# Altium schematic sheet impulse.SchDoc: OPO
size Letter; Author: Kuo, Huang; Revision: 4.0; SheetNumber: 2; SheetTotal: 7
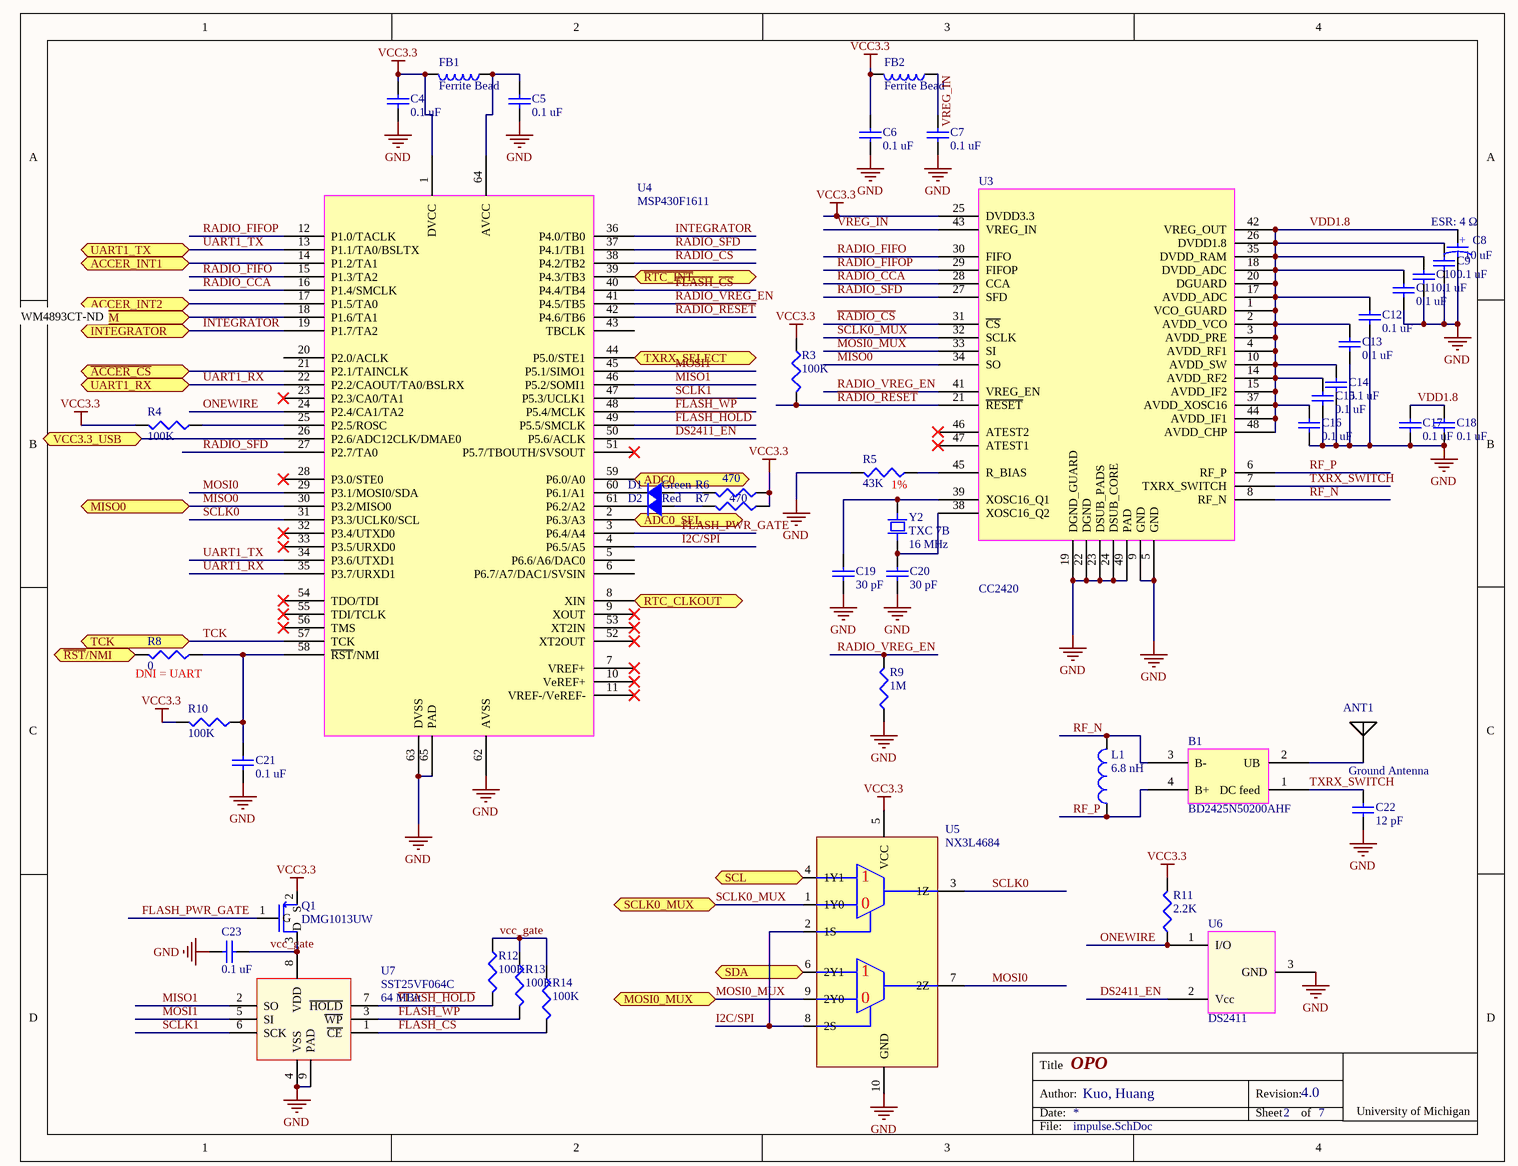
[diagram p0: impulse.SchDoc]

## Parts
ANT1  Ground Antenna  [Chip Antenna]
B1  BD2425N50200AHF  [BD2425N50200AHF]
C4  value 0.1 uF  [0402]  (hidden comment: Ceramic capacitor)
C5  value 0.1 uF  [0402]  (hidden comment: Ceramic capacitor)
C6  value 0.1 uF  [0402]  (hidden comment: Ceramic capacitor)
C7  value 0.1 uF  [0402]  (hidden comment: Ceramic capacitor)
C8  value 10 uF  ESR: 4 Ω  [0603 - Polar Marking]  (hidden comment: Tantalum capacitor)
C9  value 0.1 uF  [0402]  (hidden comment: Ceramic capacitor)
C10  value 0.1 uF  [0402]  (hidden comment: Ceramic capacitor)
C11  value 0.1 uF  [0402]  (hidden comment: Ceramic capacitor)
C12  value 0.1 uF  [0402]  (hidden comment: Ceramic capacitor)
C13  value 0.1 uF  [0402]  (hidden comment: Ceramic capacitor)
C14  value 0.1 uF  [0402]  (hidden comment: Ceramic capacitor)
C15  value 0.1 uF  [0402]  (hidden comment: Ceramic capacitor)
C16  value 0.1 uF  [0402]  (hidden comment: Ceramic capacitor)
C17  value 0.1 uF  [0402]  (hidden comment: Ceramic capacitor)
C18  value 0.1 uF  [0402]  (hidden comment: Ceramic capacitor)
C19  value 30 pF  [0402]  (hidden comment: Ceramic capacitor)
C20  value 30 pF  [0402]  (hidden comment: Ceramic capacitor)
C21  value 0.1 uF  [0402]  (hidden comment: Ceramic capacitor)
C22  value 12 pF  [0402]  (hidden comment: Ceramic capacitor)
C23  value 0.1 uF  [0402]  (hidden comment: Ceramic capacitor)
D1  Color: Green  [0402 - DIODE]  (hidden comment: LED, Green)
D2  Color: Red  [0402 - DIODE]  (hidden comment: LED, Red)
FB1  Ferrite Bead  [0402]
FB2  Ferrite Bead  [0402]
L1  value 6.8 nH  [0402]  (hidden comment: Chip inductor)
Q1  DMG1013UW  [SC70-3]
R3  value 100K  [0402]  (hidden comment: Chip resistor)
R4  value 100K  [0402]  (hidden comment: Chip resistor)
R5  value 43K  [0402]  (hidden comment: Chip resistor)
R6  value 470  [0402]  (hidden comment: Chip resistor)
R7  value 470  [0402]  (hidden comment: Chip resistor)
R8  value 0  [0402]  (hidden comment: Chip resistor)
R9  value 1M  [0402]  (hidden comment: Chip resistor)
R10  value 100K  [0402]  (hidden comment: Chip resistor)
R11  value 2.2K  [0402]  (hidden comment: Chip resistor)
R12  value 100K  [0402]  (hidden comment: Chip resistor)
R13  value 100K  [0402]  (hidden comment: Chip resistor)
R14  value 100K  [0402]  (hidden comment: Chip resistor)
U3  CC2420  [QFN50P700X700X100_HS-49N]
U4  MSP430F1611  [QFN50P900X900X90_HS-65N]
U5  NX3L4684  [QFN50P155X200X13-10N]
U6  DS2411  [SOT23-3N]
U7  SST25VF064C  Capacity: 64 MBit  [WSON]
Y2  TXC 7B  frequency: 16 MHz  [TXC 7B]

## Ports
ACCER_INT1, ACCER_INT2, ADC0, ADC0_SEL, INTEGRATOR, MISO0, MOSI0_MUX, PWM, RTC_CLKOUT, SCL, SCLK0_MUX, SDA, TCK, TXRX_SELECT, UART1_RX, UART1_TX, VCC3.3_USB, ~{ACCER_CS}, ~{RST}/NMI, ~{RTC_INT}

## Nets
GND: C4.2 C5.2 C6.2 C7.2 C8.2 C9.2 C10.2 C11.2 C12.2 C13.2 C14.2 C15.2 C16.2 C17.2 C18.2 C19.1 C20.1 C21.2 C22.2 C23.2 R5.1 R9.2 U3.5(GND) U3.9(GND) U3.19(DGND_GUARD) U3.22(DGND) U3.23(DSUB_PADS) U3.24(DSUB_CORE) U3.49(PAD) U4.62(AVSS) U4.63(DVSS) U4.65(PAD) U5.10(GND) U6.3(GND) U7.4(VSS) U7.9(PAD)
VCC3.3: C4.1 C6.1 FB1.1 FB2.1 Q1.2(S) R3.2 R4.1 R6.2 R7.2 R10.1 R11.1 U3.25(DVDD3.3) U4.1(DVCC) U5.5(VCC)
~{ACCER_CS}: U4.21(P2.1/TAINCLK) ; port ~{ACCER_CS}
ACCER_INT1: U4.14(P1.2/TA1) ; port ACCER_INT1
ACCER_INT2: U4.17(P1.5/TA0) ; port ACCER_INT2
ADC0: U4.59(P6.0/A0) ; port ADC0
ADC0_SEL: U4.2(P6.3/A3) ; port ADC0_SEL
DS2411_EN: U4.50(P5.6/ACLK) U6.2(Vcc)
~{FLASH_HOLD}: R12.1 U4.49(P5.5/SMCLK) U7.7(~{HOLD})
~{FLASH_WP}: R13.1 U4.48(P5.4/MCLK) U7.3(~{WP})
~{FLASH}_~{CS}: R14.1 U4.40(P4.4/TB4) U7.1(~{CE})
FLASH_PWR_GATE: Q1.1(G) U4.3(P6.4/A4)
I2C/SPI: U4.4(P6.5/A5) U5.2(1S) U5.8(2S)
INTEGRATOR: U4.19(P1.7/TA2) U4.36(P4.0/TB0) ; port INTEGRATOR
MISO0: U3.34(SO) U4.30(P3.2/MISO0) ; port MISO0
MISO1: U4.46(P5.2/SOMI1) U7.2(SO)
MOSI0: U4.29(P3.1/MOSI0/SDA) U5.7(2Z)
MOSI0_MUX: U3.33(SI) U5.9(2Y0) ; port MOSI0_MUX
MOSI1: U4.45(P5.1/SIMO1) U7.5(SI)
ONEWIRE: R11.2 U4.24(P2.4/CA1/TA2) U6.1(I/O)
PWM: U4.18(P1.6/TA1) ; port PWM
~{RADIO_CS}: U3.31(~{CS}) U4.38(P4.2/TB2)
~{RADIO_RESET}: R3.1 U3.21(~{RESET}) U4.42(P4.6/TB6)
~{RST}/NMI: R8.1 ; port ~{RST}/NMI
~{RTC_INT}: U4.39(P4.3/TB3) ; port ~{RTC_INT}
RADIO_CCA: U3.28(CCA) U4.16(P1.4/SMCLK)
RADIO_FIFO: U3.30(FIFO) U4.15(P1.3/TA2)
RADIO_FIFOP: U3.29(FIFOP) U4.12(P1.0/TACLK)
RADIO_SFD: U3.27(SFD) U4.27(P2.7/TA0) U4.37(P4.1/TB1)
RADIO_VREG_EN: R9.1 U3.41(VREG_EN) U4.41(P4.5/TB5)
RF_N: B1.3(B-) L1.1 U3.8(RF_N)
RF_P: B1.4(B+) L1.2 U3.6(RF_P)
RTC_CLKOUT: U4.8(XIN) ; port RTC_CLKOUT
SCL: U5.4(1Y1) ; port SCL
SCLK0: U4.31(P3.3/UCLK0/SCL) U5.3(1Z)
SCLK0_MUX: U3.32(SCLK) U5.1(1Y0) ; port SCLK0_MUX
SCLK1: U4.47(P5.3/UCLK1) U7.6(SCK)
SDA: U5.6(2Y1) ; port SDA
TCK: U4.57(TCK) ; port TCK
TXRX_SELECT: U4.44(P5.0/STE1) ; port TXRX_SELECT
TXRX_SWITCH: B1.1(DC_feed) C22.1 U3.7(TXRX_SWITCH)
UART1_RX: U4.22(P2.2/CAOUT/TA0/BSLRX) U4.35(P3.7/URXD1) ; port UART1_RX
UART1_TX: U4.13(P1.1/TA0/BSLTX) U4.34(P3.6/UTXD1) ; port UART1_TX
VCC3.3_USB: U4.26(P2.6/ADC12CLK/DMAE0) ; port VCC3.3_USB
vcc_gate: C23.1 Q1.3(D) R12.2 R13.2 R14.2 U7.8(VDD)
VDD1.8: C8.1 C9.1 C10.1 C11.1 C12.1 C13.1 C14.1 C15.1 C16.1 C17.1 C18.1 U3.1(VCO_GUARD) U3.2(AVDD_VCO) U3.3(AVDD_PRE) U3.4(AVDD_RF1) U3.10(AVDD_SW) U3.14(AVDD_RF2) U3.15(AVDD_IF2) U3.17(AVDD_ADC) U3.18(DVDD_ADC) U3.20(DGUARD) U3.26(DVDD1.8) U3.35(DVDD_RAM) U3.37(AVDD_XOSC16) U3.42(VREG_OUT) U3.44(AVDD_IF1) U3.48(AVDD_CHP)
VREG_IN: C7.1 FB2.2 U3.43(VREG_IN)
NetANT1_1: ANT1.1 B1.2(UB)
NetC5_1: C5.1 FB1.2 U4.64(AVCC)
NetC19_2: C19.2 U3.39(XOSC16_Q1) Y2.1
NetC20_2: C20.2 U3.38(XOSC16_Q2) Y2.3
NetC21_1: C21.1 R8.2 R10.2 U4.58(~{RST}/NMI)
NetD1_1: D1.1 R6.1
NetD1_2: D1.2 U4.60(P6.1/A1)
NetD2_1: D2.1 R7.1
NetD2_2: D2.2 U4.61(P6.2/A2)
NetR4_2: R4.2 U4.25(P2.5/ROSC)
NetR5_2: R5.2 U3.45(R_BIAS)

Not connected (* = marked no-connect by the designer): U3 46(ATEST2)* 47(ATEST1)*; U4 5(P6.6/A6/DAC0) 6(P6.7/A7/DAC1/SVSIN) 7(VREF+)* 9(XOUT)* 10(VeREF+)* 11(VREF-/VeREF-)* 20(P2.0/ACLK) 23(P2.3/CA0/TA1)* 28(P3.0/STE0)* 32(P3.4/UTXD0)* 33(P3.5/URXD0)* 43(TBCLK) 51(P5.7/TBOUTH/SVSOUT)* 52(XT2OUT)* 53(XT2IN)* 54(TDO/TDI)* 55(TDI/TCLK)* 56(TMS)*

## Notes on the sheet
- WM4893CT-ND
- (near R5) 1%
- (near R8) DNI = UART
- Title
- Date:
- Author:
- Revision:
- Sheet
- of
- University of Michigan
- File:
- (in symbol C_10u_0603_tantalum) +
- (in symbol NX3L4684) 0

## Library data of the parts
ANT1 = Ground Antenna: 2.4GHz Surface Mount Device (SMD) On Ground Antenna, 50 Ohms; Supplier 1: Digi-Key; Supplier Part Number 1: WM4893CT-ND
B1 = BD2425N50200AHF: Ultra Low Profile 0404 Balun   50Ω to 200Ω Balanced; Supplier 1: Digi-Key; Supplier Part Number 1: 1173-1063-1-ND
C4-C7 C9-C18 C21 C23 = C_0.1u_0402_ceramic: Ceramic capacitor, 0.1u, 0402 package; Manufacture: TDK; voltage rated: 10 V; tolerance: 10%; Supplier 1: Digi-Key; Supplier Part Number 1: 445-1265-1-ND; package: 0402
C8 = C_10u_0603_tantalum: Tantalum capacitor, 10 uF, 0603 package; Manufacture: AVX; voltage rated: 6.3V; tolerance: 10%; package: 0603; Supplier 1: Digi-Key; Supplier Part Number 1: 478-4959-1-ND
C19 C20 = C_30p_0402_ceramic: Ceramic capacitor, 30 pF, 0402 package; Manufacture: Johanson; voltage rated: 50 V; tolerance: 2%; package: 0402; Supplier 1: Digi-Key; Supplier Part Number 1: 712-1295-1-ND
C22 = C_12p_0402_ceramic: Ceramic capacitor, 12 pF, 0402 package; Manufacture: Johanson; voltage rated: 50 V; tolerance: 2%; package: 0402; Supplier 1: Digi-Key; Supplier Part Number 1: 712-1256-1-ND
D1 = D_LED_GREEN_0402: LED, Green,  0402; package: 0402; Supplier 1: Digi-Key; Supplier Part Number 1: 511-1592-1-ND
D2 = D_LED_RED_0402: LED, Red, 0402; package: 0402; Supplier 1: Digi-Key; Supplier Part Number 1: 511-1593-1-ND
FB1 FB2 = FB_150mA_0402: Ferrite Bead, 150 mA, 0402 package; impedance@Freq: 1K@100 MHz; current rating: 150 mA; Supplier 1: Digi-Key; Supplier Part Number 1: 587-1835-1-ND; package: 0402
L1 = L_6.8n_0402: Chip inductor, 6.8 nH, 0402 package; tolerance: 5%; package: 0402; Supplier 1: Digi-Key; Supplier Part Number 1: 712-1419-1-ND
Q1 = DMG1013UW: P-CHANNEL ENHANCEMENT MODE MOSFET; Supplier 1: Digi-Key; Supplier Part Number 1: DMG1013UW-7DICT-ND
R3 R4 R10 R12-R14 = R_100K_0402: Chip resistor, 100K, 0402 package; tolerance: 1%; power: 1/16 W; Supplier 1: Digi-Key; Supplier Part Number 1: 541-100KLCT-ND; package: 0402
R5 = R_43K_0402: Chip resistor, 43K, 0402 package; tolerance: 1%; power: 1/16 W; Supplier 1: Digi-Key; Supplier Part Number 1: 541-43.0KLCT-ND; package: 0402
R6 R7 = R_470_0402: Chip resistor, 470, 0402 package; tolerance: 1%; power: 1/16 W; Supplier 1: Digi-Key; Supplier Part Number 1: 541-470LCT-ND; package: 0402
R8 = R_0_0402: Chip resistor, 0, 0402 package; package: 0402; Supplier 1: Digi-Key; Supplier Part Number 1: 541-0.0YBCT-ND
R9 = R_1M_0402: Chip resistor, 1M, 0402 package; tolerance: 1%; power: 1/16 W; Supplier 1: Digi-Key; Supplier Part Number 1: 541-1.00MLCT-ND; package: 0402
R11 = R_2.2K_0402: Chip resistor, 2.2K, 0402 package; tolerance: 1%; power: 1/16 W; package: 0402; Supplier 1: Digi-Key; Supplier Part Number 1: 541-2.20KLCT-ND
U3 = CC2420: 2.4 GHz IEEE 802.15.4 / ZigBee-ready RF Transceiver; Supplier 1: Digi-Key; Supplier Part Number 1: 296-19585-1-ND
U4 = MSP430F1611: MIXED SIGNAL MICROCONTROLLER; Supplier 1: Digi-Key; Supplier Part Number 1: 296-18102-1-ND
U5 = NX3L4684: IC ANALOG SWITCH SPDT 10XQFN; Supplier 1: Digi-Key; Supplier Part Number 1: 568-5564-1-ND
U6 = DS2411: Silicon Serial Number with VCC Input; Supplier 1: Digi-Key; Supplier Part Number 1: DS2411R+CT-ND
U7 = SST25VF064C: 64 Mbit SPI Serial Dual I/O Flash; Supplier 1: Digi-Key; Supplier Part Number 1: SST25VF064C-80-4I-Q2AE-CT-ND
Y2 = TXC 7B: 5 x 3.2 mm SMD SEAM CRYSTAL 7B SERIES; Load capatance: 18 pF; ESR: 40; stability: 30 ppm; Supplier 1: Digi-Key; Supplier Part Number 1: 887-1104-1-ND